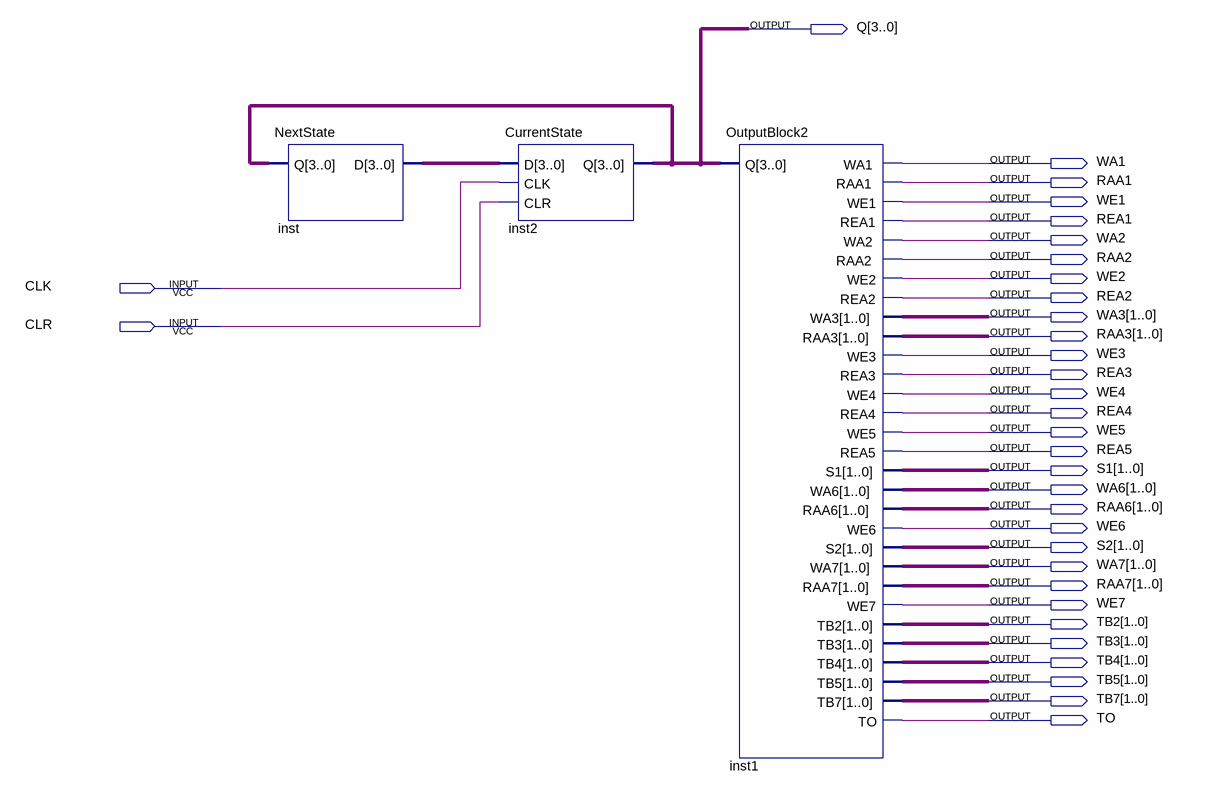
[diagram p0: schematic sheet]
// Quartus schematic Control.bdf as structural Verilog: 3 symbols, 33 pins
module Control (
  input  CLK,
  input  CLR,
  output [3:0] Q,
  output WA1,
  output RAA1,
  output WE1,
  output REA1,
  output WA2,
  output RAA2,
  output WE2,
  output REA2,
  output [1:0] WA3,
  output [1:0] RAA3,
  output WE3,
  output REA3,
  output WE4,
  output REA4,
  output WE5,
  output REA5,
  output [1:0] S1,
  output [1:0] WA6,
  output [1:0] RAA6,
  output WE6,
  output [1:0] S2,
  output [1:0] WA7,
  output [1:0] RAA7,
  output WE7,
  output [1:0] TB2,
  output [1:0] TB3,
  output [1:0] TB4,
  output [1:0] TB5,
  output [1:0] TB7,
  output TO
);

  wire [3:0] inst_d;

  NextState inst (.Q(Q), .D(inst_d));
  CurrentState inst2 (.D(inst_d), .CLK(CLK), .CLR(CLR), .Q(Q));
  OutputBlock2 inst1 (
    .Q(Q), .WA1(WA1), .RAA1(RAA1), .WE1(WE1), .REA1(REA1), .WA2(WA2), .RAA2(RAA2), .WE2(WE2), .REA2(REA2),
    .WA3(WA3), .RAA3(RAA3), .WE3(WE3), .REA3(REA3), .WE4(WE4), .REA4(REA4), .WE5(WE5), .REA5(REA5), .S1(S1),
    .WA6(WA6), .RAA6(RAA6), .WE6(WE6), .S2(S2), .WA7(WA7), .RAA7(RAA7), .WE7(WE7), .TB2(TB2), .TB3(TB3),
    .TB4(TB4), .TB5(TB5), .TB7(TB7), .TO(TO));
endmodule
